# EAGLE design ESP01 Breakout (EAGLE 6.5.0)
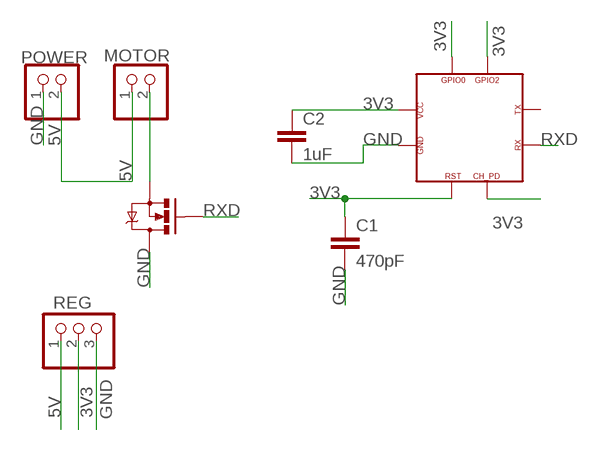
[diagram p0: schematic, sheet 1]

## Parts
C1  470pF  CAPEZ  [CAP-PTH-SMALLEZ]
C2  1uF  CAPEZ  [CAP-PTH-SMALLEZ]
MOTOR  PINHD-1X2/90  [1X02/90]
POWER  PINHD-1X2/90  [1X02/90]
Q1  MOSFET-NCHANNEL2N7000  [TO-92]
REG  PINHD-1X3  [1X03]
U$2  ESP-01  [ESP-01]

## Nets
3V3: C1.1 C2.1 REG.2 U$2.CH_PD(CP_PD) U$2.GPIO0 U$2.GPIO2 U$2.RST U$2.VCC
5V: MOTOR.1 POWER.2 REG.1
GND: C1.2 C2.2 POWER.1 Q1.3(D) REG.3 U$2.GND
N$1: MOTOR.2 Q1.1(S)
RXD: Q1.2(G) U$2.RXD(RX)
Unconnected: U$2.TXD(TX)

## Library data of the parts
C1 C2 = SparkFun-Capacitors:CAP: Capacitor Standard 0603 ceramic capacitor, and 0.1" leaded capacitor.
MOTOR POWER = pinhead:PINHD-1X2: PIN HEADER
Q1 = SparkFun-DiscreteSemi:MOSFET-NCHANNEL: Common NMOSFET Parts MFG P/N Store ID Prod ID FDD8780 TRANS-09984 SI7820DN TRANS-11055 FDS6630A IC-08089 2N7002PW TRANS-11151 FQP30N06L COM-10213 TRANS-10060 BSS123LT1G TRANS-08345 BSS138 TRANS-00830 BS170 2N7000
REG = pinhead:PINHD-1X3: PIN HEADER
U$2 = Franc:ESP-01

## Net classes
0 default: width 0.406 mm, clearance 0.406 mm

## Board
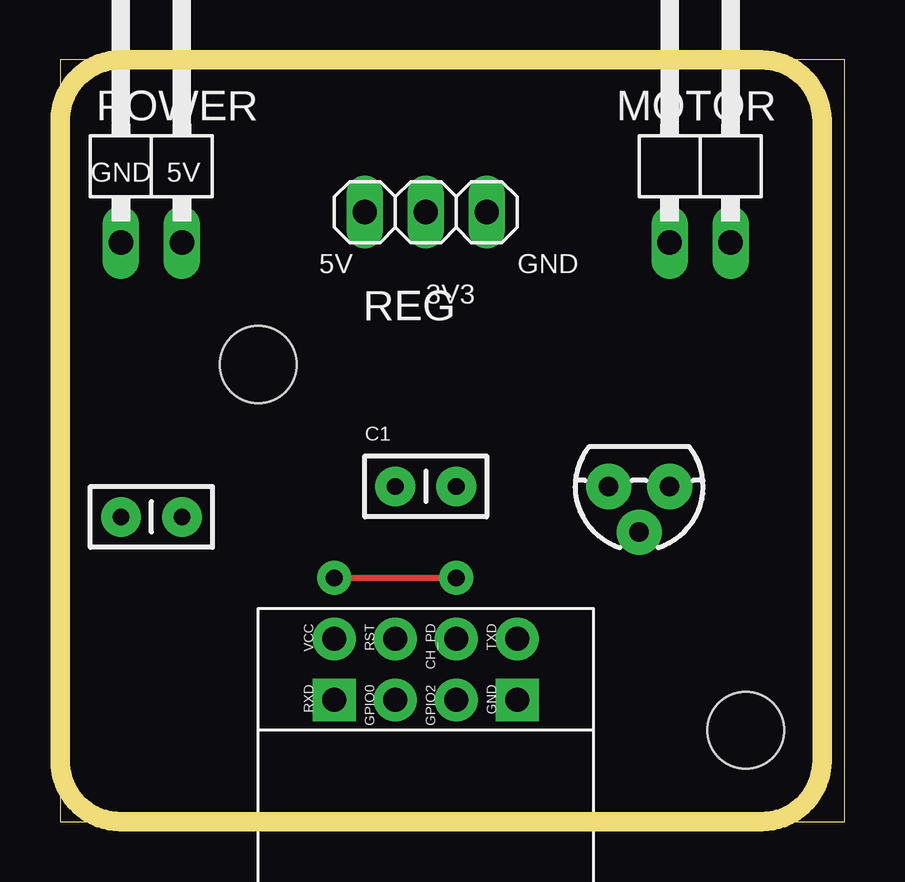
[diagram p1: board, top side]
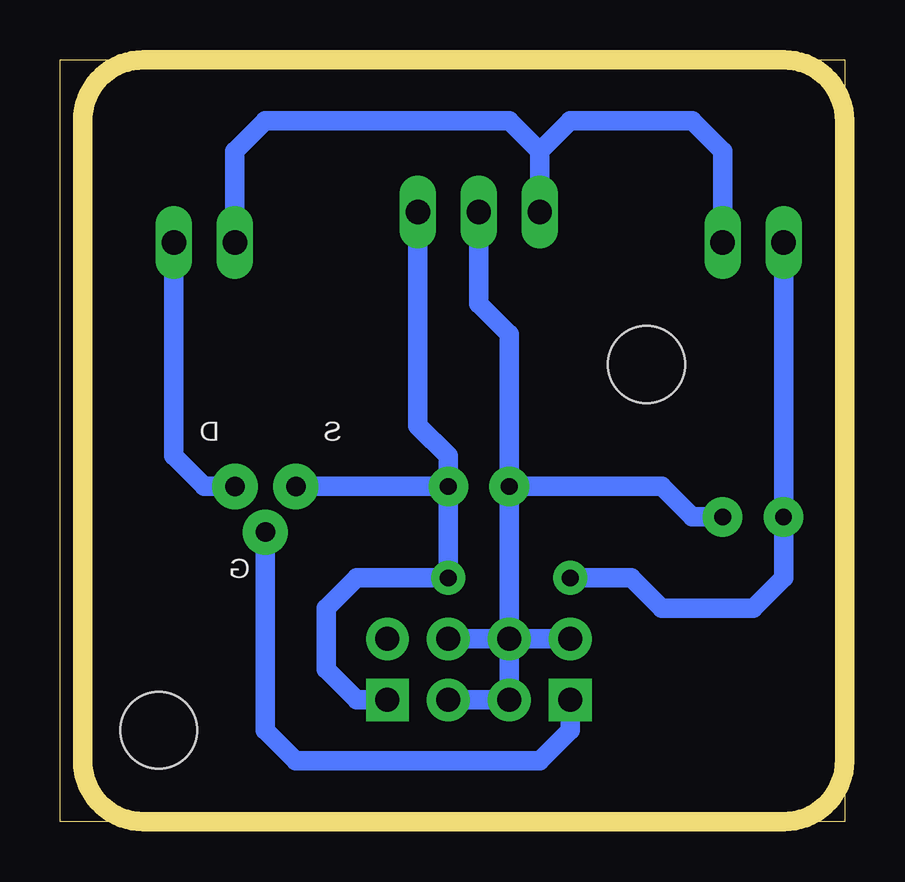
[diagram p2: board, bottom side, seen from below]

Size 32.69 x 31.74 mm. Coordinates in mm from the lower left corner, seen from the top.
Outline: 0,0 32.69,0 32.69,31.74 0,31.74 0,0
Copper layers (1*16): Top 0.035mm / dielectric 1.5mm / Bottom 0.035mm
Design rules "default": minimum track width 10mil, minimum drill 24mil, track to track 8mil, track to pad 8mil, pad to pad 8mil, via to via 8mil, smd to smd 8mil, copper to edge 40mil, drill to drill 8mil, minimum pad ring 10mil, minimum via ring 8mil, stop-mask expansion 4mil, vias tented up to drill 0mil, thermal gap 10mil
Holes 3.2 mm at 28.57,3.81 8.26,19.05
Milling: 8 lines

### Footprints (pad centres in the part's own frame; a part is rotated, then mirrored left to right if it is on the bottom)
CAP-PTH-SMALLEZ = drill 0.7 pad 1.651: 1 0,0; 2 2.54,0
1X02/90 = drill 1.016 long: 1 -1.27,-3.81; 2 1.27,-3.81
TO-92 = drill 0.813 pad 1.88: 1 -1.27,0; 2 0,1.905; 3 1.27,0
1X03 = drill 1.016 long: 1 -2.54,0; 2 0,0; 3 2.54,0
ESP-01 = drill 1 pad 1.778: CH_PD -1.27,1.27; GPIO0 1.27,-1.27; GPIO2 1.27,1.27; RST -1.27,-1.27; TXD -1.27,3.81; VCC -1.27,-3.81 | drill 1 pad 1.778 square: GND 1.27,3.81; RXD 1.27,-3.81

### Placement (x,y rotation side)
C1  13.97,13.97 0 top
C2  5.08,12.7 180 top
MOTOR  26.67,27.94 0 top
POWER  3.81,27.94 0 top
Q1  24.13,13.97 180 top
REG  15.24,25.4 0 top
U$2  15.24,6.35 270 top

### Tracks (layer width: path | path; a pad name or v marks a point on that pad's centre or on a via)
3V3
  Bottom 0.813: REG.2 15.24,21.59 13.97,20.32 C1.1 | C1.1 U$2.RST | U$2.RST U$2.VCC | U$2.RST U$2.CH_PD | U$2.RST U$2.GPIO0 U$2.GPIO2 | C2.1 6.35,12.7 7.62,13.97 C1.1
5V
  Bottom 0.813: REG.1 12.7,27.94 | 12.7,27.94 13.97,29.21 24.13,29.21 25.4,27.94 MOTOR.1 | POWER.2 5.08,27.94 6.35,29.21 11.43,29.21 12.7,27.94
GND  (via drill 0.7 pad 1.42)
  Top 0.254: v11.43,10.16 v16.51,10.16
  Bottom 0.813: POWER.1 C2.2 2.54,10.16 3.81,8.89 7.62,8.89 8.89,10.16 v11.43,10.16 | U$2.GND 20.32,5.08 21.59,6.35 21.59,8.89 20.32,10.16 v16.51,10.16 C1.2 | C1.2 Q1.3 | REG.3 17.78,16.51 16.51,15.24 C1.2
N$1
  Bottom 0.813: MOTOR.2 27.94,15.24 26.67,13.97 Q1.1
RXD
  Bottom 0.813: U$2.RXD 11.43,3.81 12.7,2.54 22.86,2.54 24.13,3.81 Q1.2

### Text on the board
tNames: GND | 5V | 5V | GND | 3V3
bNames: S | D | G